# Altium schematic sheet Dashcam - Top Level.SchDoc: Top Level
size A2; DrawnBy: ELIO F.; Engineer: ELIO F.; Revision: A; SheetNumber: 2; SheetTotal: 22; Sheet Title: Top Level; Version: 1.0
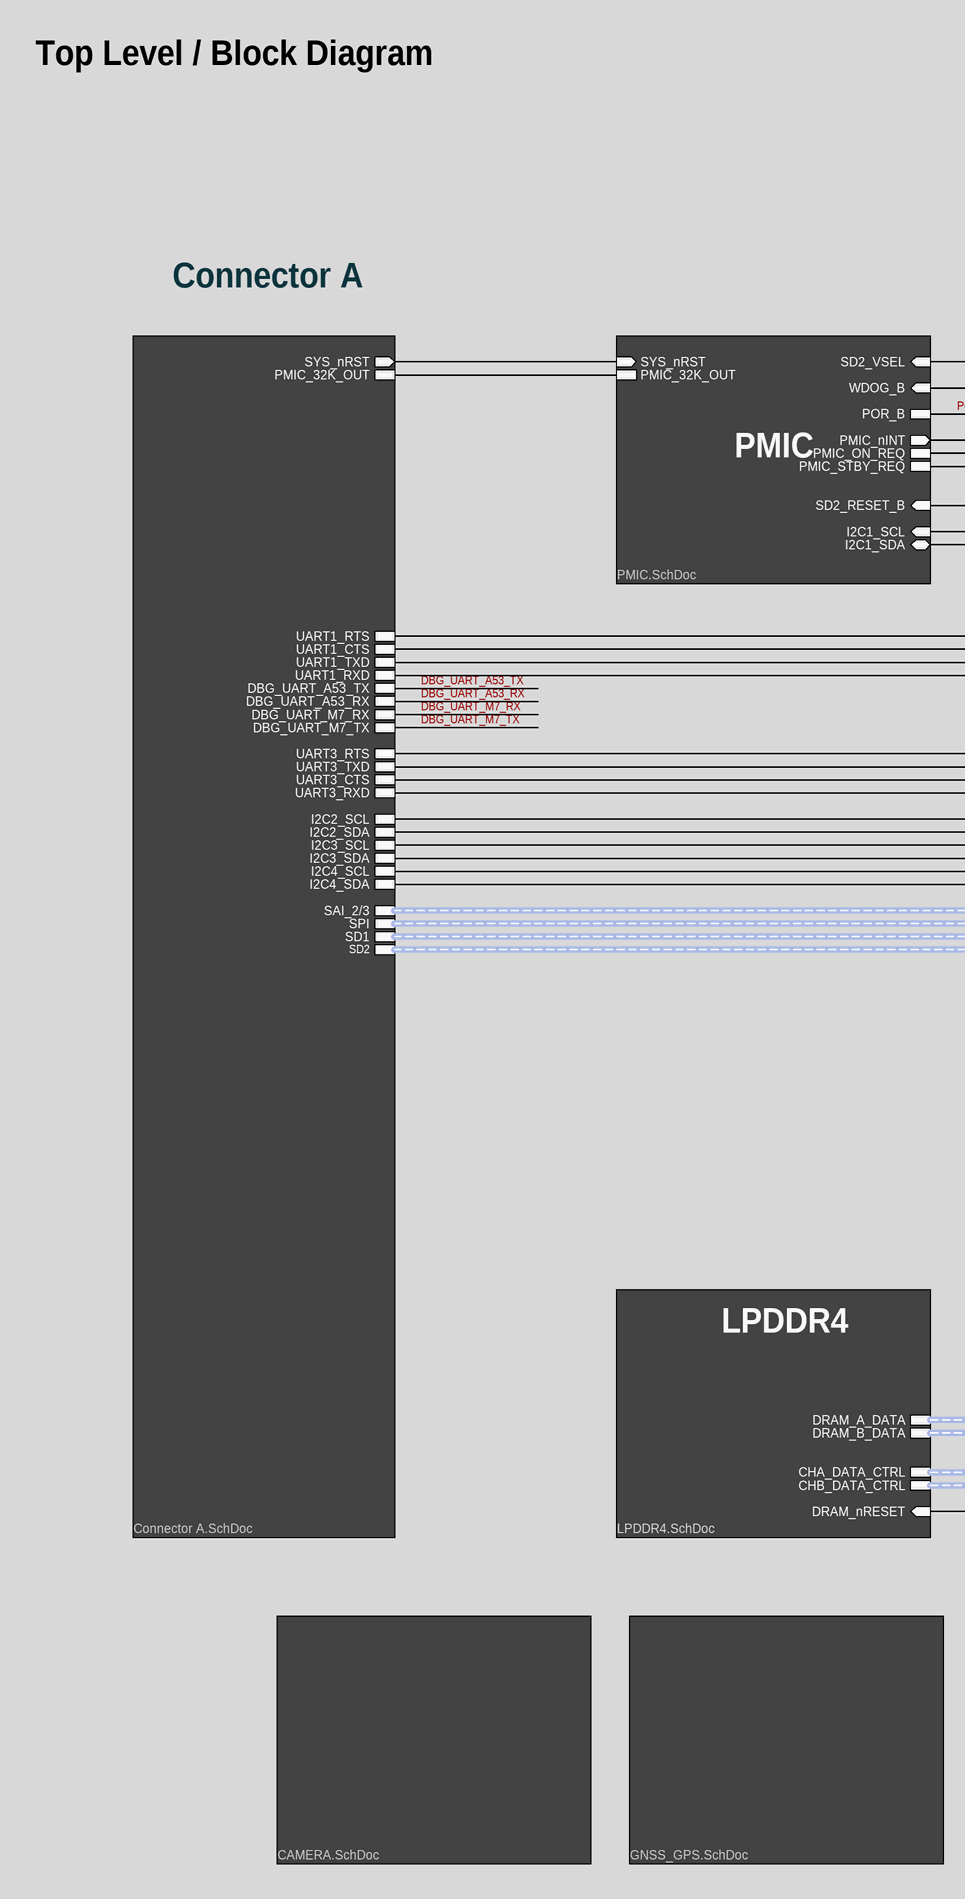
[diagram p0: Dashcam - Top Level.SchDoc, left]
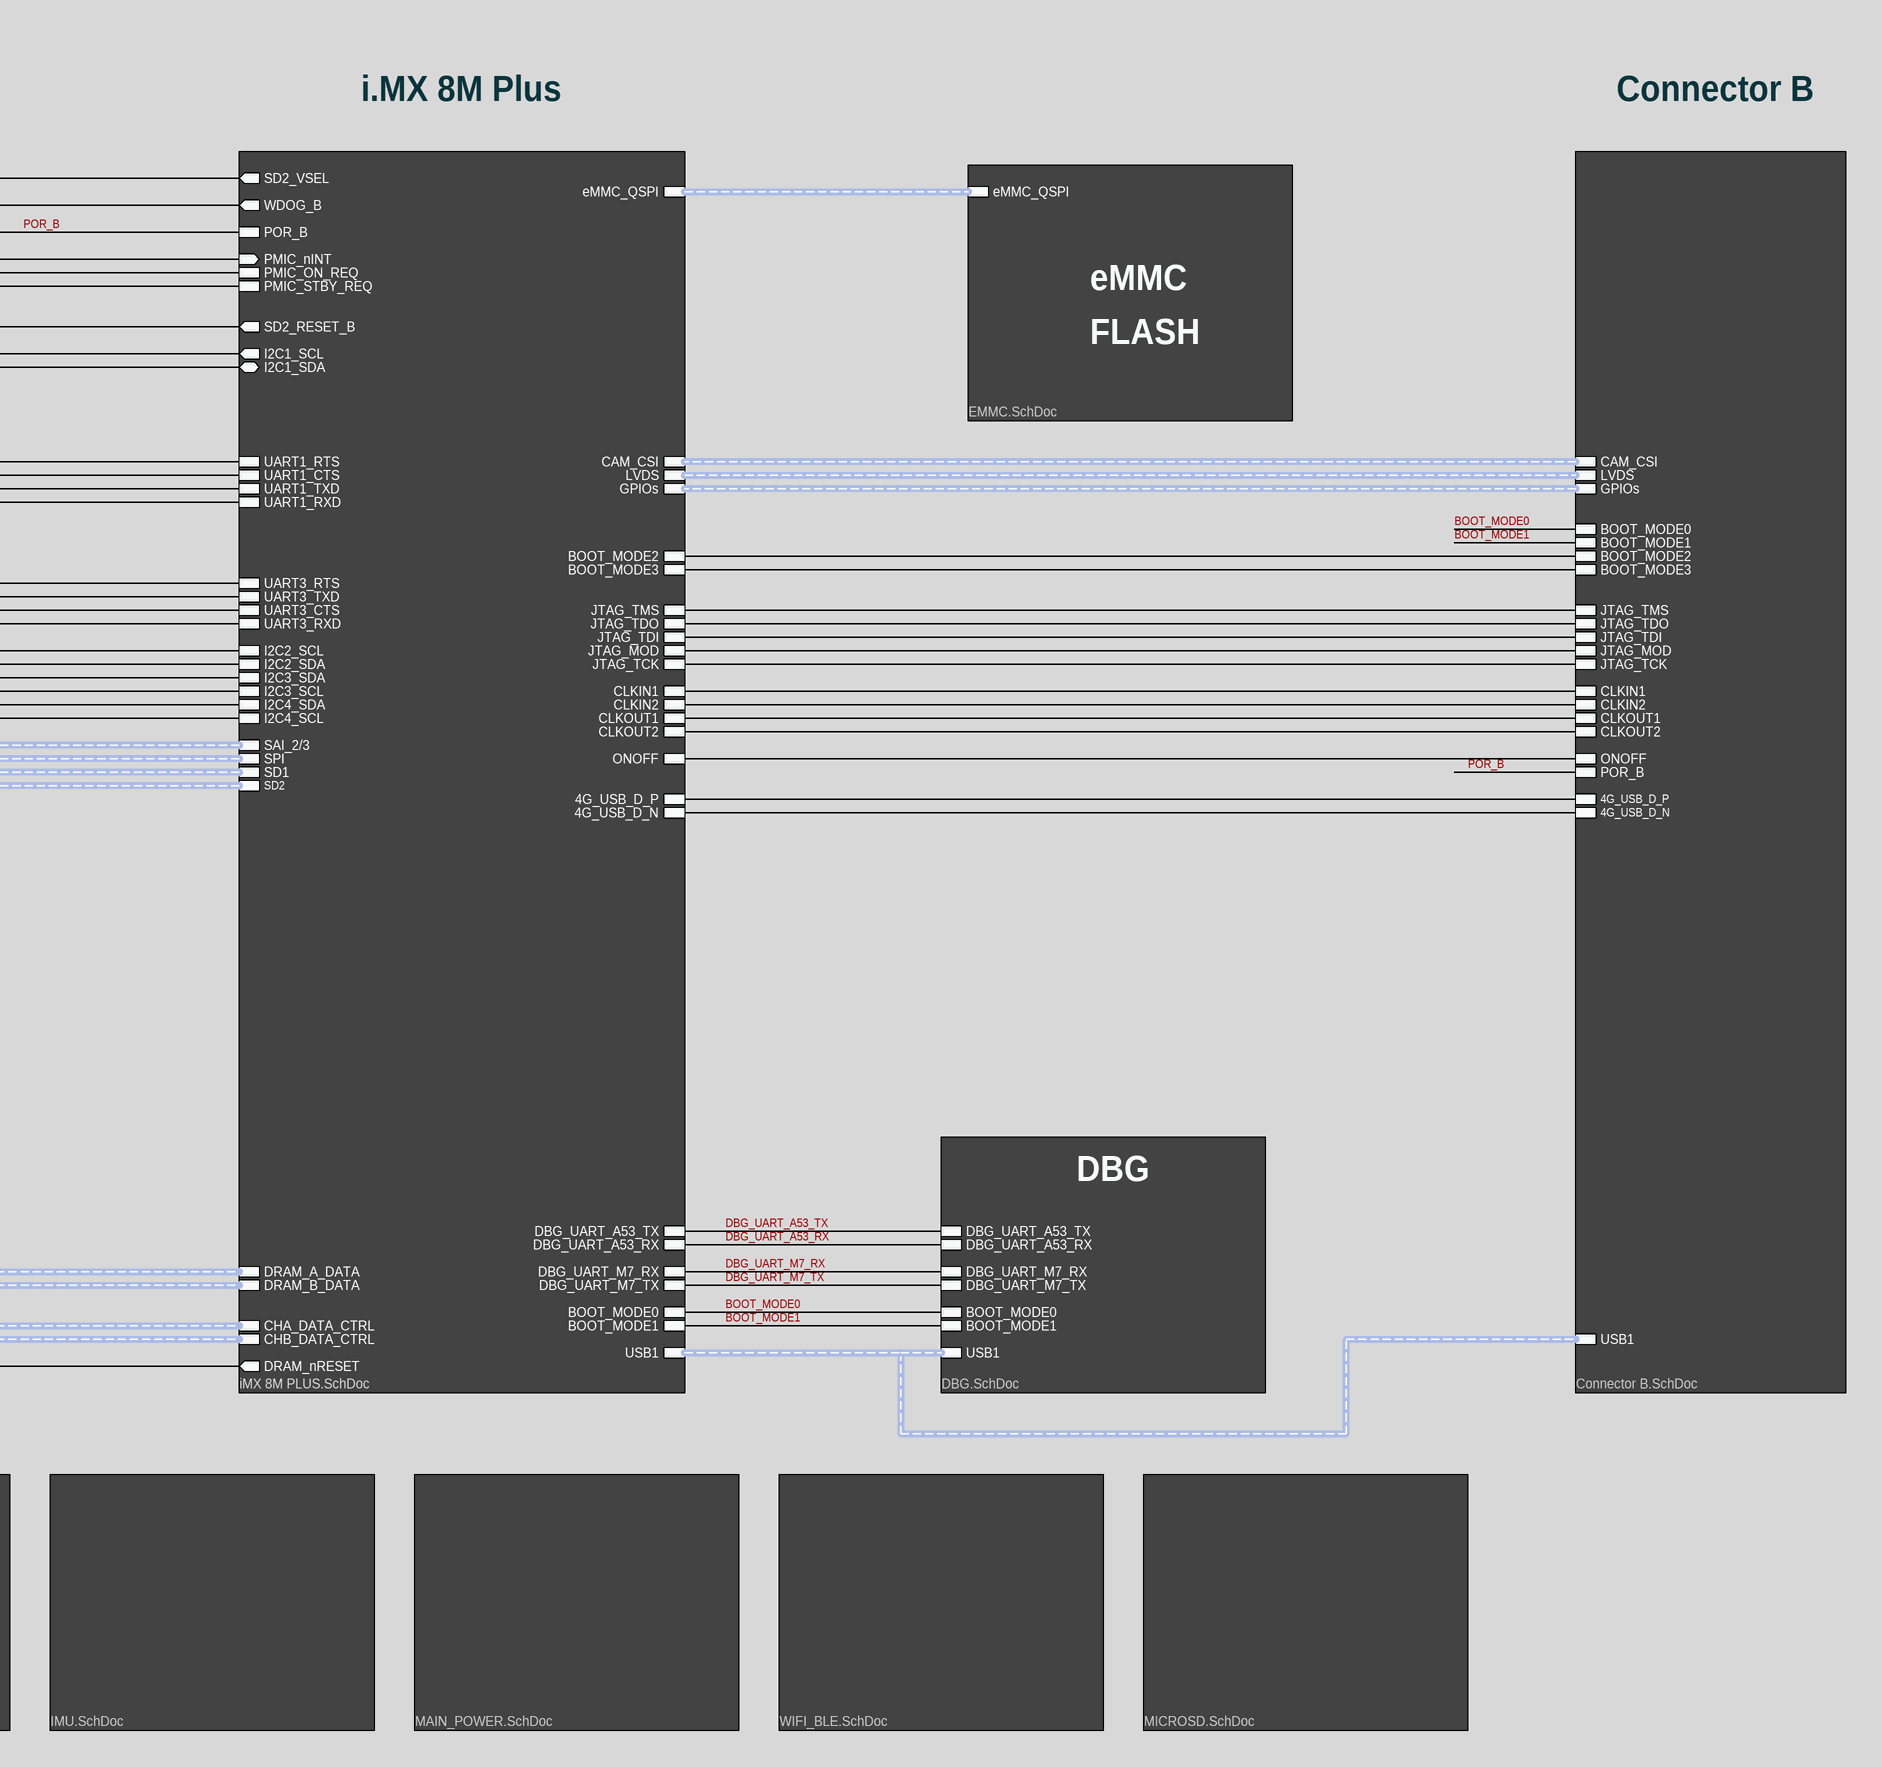
[diagram p1: Dashcam - Top Level.SchDoc, right]

## Sub-sheets
A = iMX 8M PLUS.SchDoc: DRAM_A_DATA (harness DRAM_A), DRAM_B_DATA (harness DRAM_A), CHA_DATA_CTRL (harness DRAM_A), CHB_DATA_CTRL (harness DRAM_A), DRAM_nRESET (out), DBG_UART_A53_TX, DBG_UART_A53_RX, DBG_UART_M7_RX, DBG_UART_M7_TX, BOOT_MODE0, BOOT_MODE1, USB1 (harness DRAM_A), eMMC_QSPI (harness DRAM_A), I2C1_SCL (out), I2C1_SDA (bidir), PMIC_nINT (in), SD2_VSEL (out), WDOG_B (out), SD2_RESET_B (out), ONOFF, POR_B, PMIC_ON_REQ, PMIC_STBY_REQ, UART1_RTS, UART1_CTS, UART1_TXD, UART1_RXD, I2C2_SCL, I2C2_SDA, I2C3_SCL, I2C3_SDA, I2C4_SCL, I2C4_SDA, UART3_RTS, UART3_TXD, UART3_CTS, UART3_RXD, BOOT_MODE2, BOOT_MODE3, CLKIN1, CLKIN2, CLKOUT1, CLKOUT2, CAM_CSI (harness DRAM_A), LVDS (harness DRAM_A), GPIOs (harness DRAM_A), SAI_2/3 (harness DRAM_A), SPI (harness DRAM_A), JTAG_TDI, JTAG_TMS, JTAG_TCK, JTAG_TDO, JTAG_MOD, SD1 (harness DRAM_A), SD2 (harness DRAM_A), 4G_USB_D_P, 4G_USB_D_N
B = Connector A.SchDoc: PMIC_32K_OUT, DBG_UART_A53_TX, DBG_UART_A53_RX, DBG_UART_M7_RX, DBG_UART_M7_TX, UART1_RTS, UART1_CTS, UART1_TXD, UART1_RXD, I2C2_SCL, I2C2_SDA, I2C3_SCL, I2C3_SDA, I2C4_SCL, I2C4_SDA, UART3_RTS, UART3_TXD, UART3_CTS, UART3_RXD, SYS_nRST (out), SAI_2/3 (harness SAI2), SPI (harness SPI), SD1 (harness SD1), SD2 (harness SD2)
C = Connector B.SchDoc: CAM_CSI (harness CAM_CSI), LVDS (harness LVDS), GPIOs (harness GPIOs), USB1 (harness USB1), BOOT_MODE1, BOOT_MODE3, BOOT_MODE0, BOOT_MODE2, JTAG_TMS, JTAG_TDO, JTAG_TDI, JTAG_MOD, JTAG_TCK, ONOFF, CLKIN2, CLKOUT2, CLKIN1, CLKOUT1, POR_B, 4G_USB_D_N, 4G_USB_D_P
Q = PMIC.SchDoc: PMIC_ON_REQ, PMIC_STBY_REQ, WDOG_B (in), SYS_nRST (in), I2C1_SCL (in), I2C1_SDA (bidir), POR_B, PMIC_nINT (out), PMIC_32K_OUT, SD2_RESET_B (in), SD2_VSEL (in)
R = LPDDR4.SchDoc: DRAM_A_DATA (harness DRAM_A_DATA), CHA_DATA_CTRL (harness CHA_DATA_CTRL), DRAM_B_DATA (harness DRAM_B_DATA), CHB_DATA_CTRL (harness CHB_DATA_CTRL), DRAM_nRESET (in)
S = EMMC.SchDoc: eMMC_QSPI (harness eMMC_QSPI)
S = GNSS_GPS.SchDoc: no entries
S = IMU.SchDoc: no entries
S = MAIN_POWER.SchDoc: no entries
S = CAMERA.SchDoc: no entries
S = WIFI_BLE.SchDoc: no entries
S = MICROSD.SchDoc: no entries
T = DBG.SchDoc: DBG_UART_A53_TX, DBG_UART_A53_RX, DBG_UART_M7_RX, DBG_UART_M7_TX, BOOT_MODE0, BOOT_MODE1, USB1 (harness USB1)

## Nets
BOOT_MODE0: sheet A/BOOT_MODE0, sheet C/BOOT_MODE0, sheet T/BOOT_MODE0
BOOT_MODE1: sheet A/BOOT_MODE1, sheet C/BOOT_MODE1, sheet T/BOOT_MODE1
DBG_UART_A53_RX: sheet A/DBG_UART_A53_RX, sheet B/DBG_UART_A53_RX, sheet T/DBG_UART_A53_RX
DBG_UART_A53_TX: sheet A/DBG_UART_A53_TX, sheet B/DBG_UART_A53_TX, sheet T/DBG_UART_A53_TX
DBG_UART_M7_RX: sheet A/DBG_UART_M7_RX, sheet B/DBG_UART_M7_RX, sheet T/DBG_UART_M7_RX
DBG_UART_M7_TX: sheet A/DBG_UART_M7_TX, sheet B/DBG_UART_M7_TX, sheet T/DBG_UART_M7_TX
POR_B: sheet A/POR_B, sheet C/POR_B, sheet Q/POR_B
(unnamed): sheet A/DRAM_nRESET, sheet R/DRAM_nRESET
(unnamed): sheet A/I2C1_SCL, sheet Q/I2C1_SCL
(unnamed): sheet A/I2C1_SDA, sheet Q/I2C1_SDA
(unnamed): sheet A/PMIC_nINT, sheet Q/PMIC_nINT
(unnamed): sheet A/SD2_VSEL, sheet Q/SD2_VSEL
(unnamed): sheet A/WDOG_B, sheet Q/WDOG_B
(unnamed): sheet A/SD2_RESET_B, sheet Q/SD2_RESET_B
(unnamed): sheet A/ONOFF, sheet C/ONOFF
(unnamed): sheet A/PMIC_ON_REQ, sheet Q/PMIC_ON_REQ
(unnamed): sheet A/PMIC_STBY_REQ, sheet Q/PMIC_STBY_REQ
(unnamed): sheet A/UART1_RTS, sheet B/UART1_RTS
(unnamed): sheet A/UART1_CTS, sheet B/UART1_CTS
(unnamed): sheet A/UART1_TXD, sheet B/UART1_TXD
(unnamed): sheet A/UART1_RXD, sheet B/UART1_RXD
(unnamed): sheet A/I2C2_SCL, sheet B/I2C2_SCL
(unnamed): sheet A/I2C2_SDA, sheet B/I2C2_SDA
(unnamed): sheet A/I2C3_SCL, sheet B/I2C3_SDA
(unnamed): sheet A/I2C3_SDA, sheet B/I2C3_SCL
(unnamed): sheet A/I2C4_SCL, sheet B/I2C4_SDA
(unnamed): sheet A/I2C4_SDA, sheet B/I2C4_SCL
(unnamed): sheet A/UART3_RTS, sheet B/UART3_RTS
(unnamed): sheet A/UART3_TXD, sheet B/UART3_TXD
(unnamed): sheet A/UART3_CTS, sheet B/UART3_CTS
(unnamed): sheet A/UART3_RXD, sheet B/UART3_RXD
(unnamed): sheet A/BOOT_MODE2, sheet C/BOOT_MODE2
(unnamed): sheet A/BOOT_MODE3, sheet C/BOOT_MODE3
(unnamed): sheet A/CLKIN1, sheet C/CLKIN1
(unnamed): sheet A/CLKIN2, sheet C/CLKIN2
(unnamed): sheet A/CLKOUT1, sheet C/CLKOUT1
(unnamed): sheet A/CLKOUT2, sheet C/CLKOUT2
(unnamed): sheet A/JTAG_TDI, sheet C/JTAG_TDI
(unnamed): sheet A/JTAG_TMS, sheet C/JTAG_TMS
(unnamed): sheet A/JTAG_TCK, sheet C/JTAG_TCK
(unnamed): sheet A/JTAG_TDO, sheet C/JTAG_TDO
(unnamed): sheet A/JTAG_MOD, sheet C/JTAG_MOD
(unnamed): sheet A/4G_USB_D_P, sheet C/4G_USB_D_P
(unnamed): sheet A/4G_USB_D_N, sheet C/4G_USB_D_N
(unnamed): sheet B/PMIC_32K_OUT, sheet Q/PMIC_32K_OUT
(unnamed): sheet B/SYS_nRST, sheet Q/SYS_nRST

## Buses and harness runs
harness sheet A/CAM_CSI = sheet C/CAM_CSI
harness sheet A/CHA_DATA_CTRL = sheet R/CHA_DATA_CTRL
harness sheet A/CHB_DATA_CTRL = sheet R/CHB_DATA_CTRL
harness sheet A/DRAM_A_DATA = sheet R/DRAM_A_DATA
harness sheet A/DRAM_B_DATA = sheet R/DRAM_B_DATA
harness sheet A/eMMC_QSPI = sheet S/eMMC_QSPI
harness sheet A/GPIOs = sheet C/GPIOs
harness sheet A/LVDS = sheet C/LVDS
harness sheet A/SAI_2/3 = sheet B/SAI_2/3
harness sheet A/SD1 = sheet B/SD1
harness sheet A/SD2 = sheet B/SD2
harness sheet A/SPI = sheet B/SPI
harness sheet A/USB1 = sheet C/USB1 = sheet T/USB1

## Notes on the sheet
- Top Level / Block Diagram
- Connector A
- i.MX 8M Plus
- Connector B
- PMIC
- eMMC
- FLASH
- LPDDR4
- DBG
- PCB Des :
- Approv By :
- Project Title :
- Sheet Title :
- Date :
- Page :
- PCB Version :
- PCB Revision :
- Size :
- A2